# EAGLE schematic Pradeep (EAGLE 7.6.0)
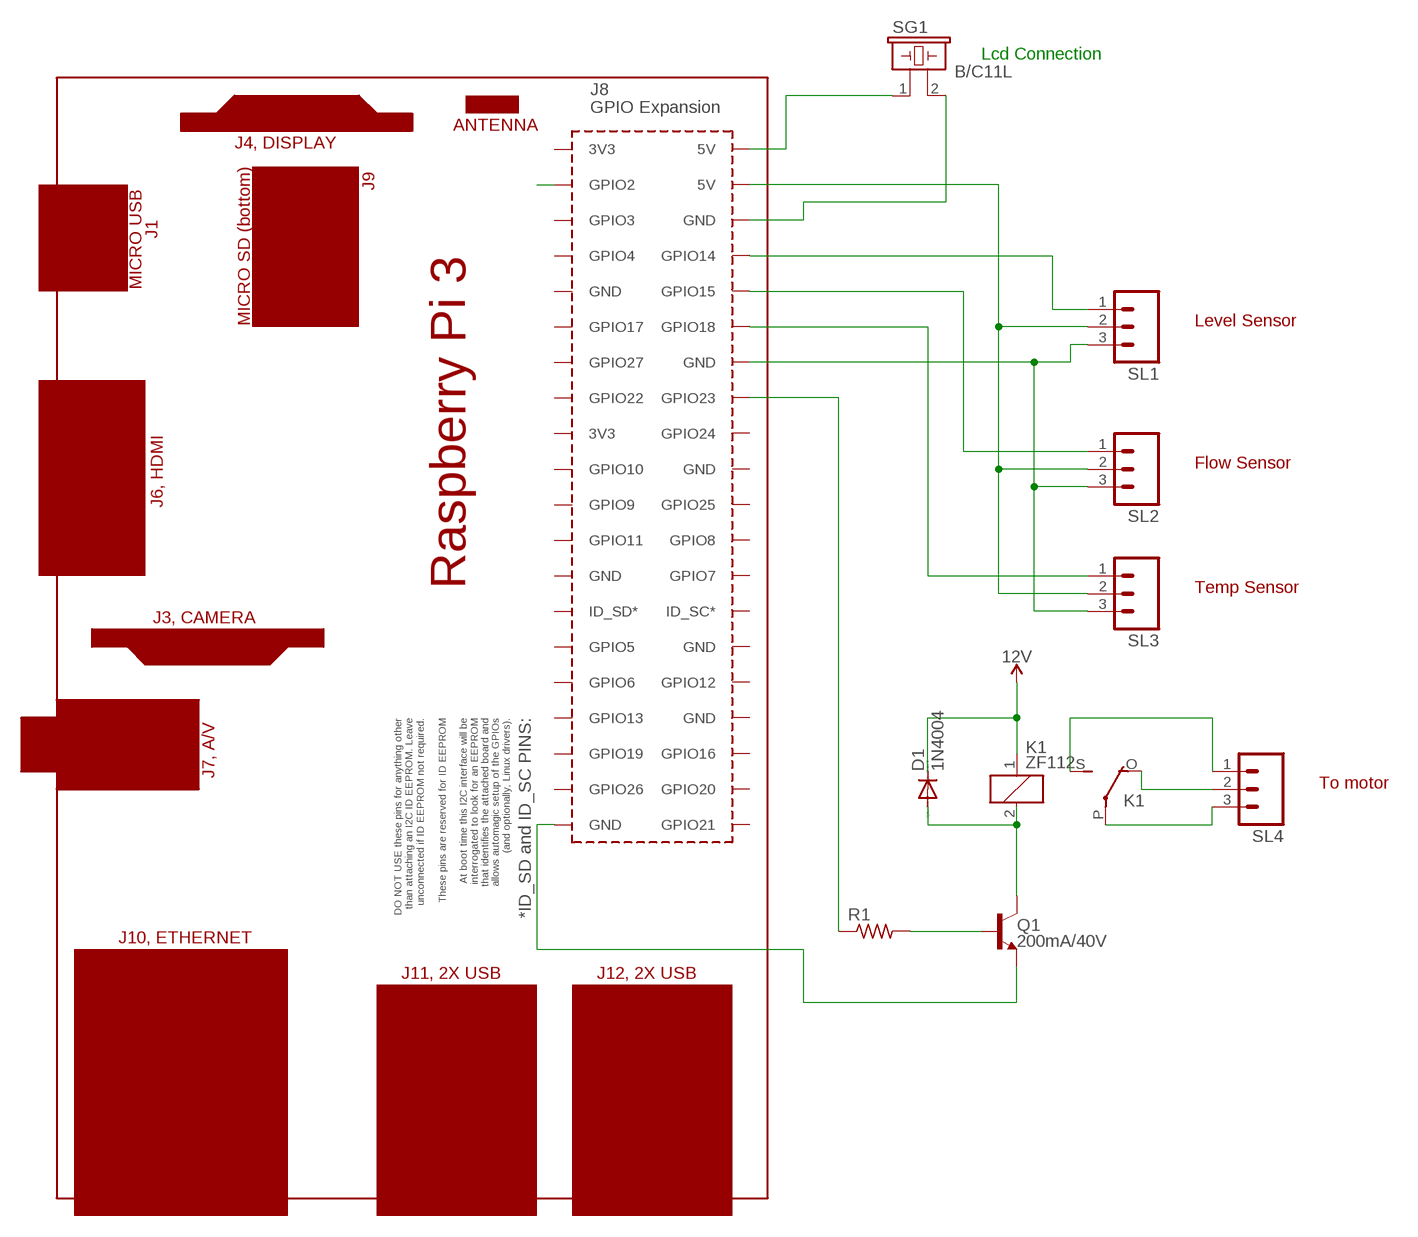
[diagram p0: schematic, sheet 1]

## Parts
D1  1N4004  [DO41-10]
K1  ZF112  [ZF112]
PCB1  RPI3_EXT  (no package)
Q1  200mA/40V  TRANS_NPN-2N3904-EZ  [TO-92-EZ]
R1  R-US_0204/7  [0204/7]
SG1  B/C11L  [B/C11L]
SL1  MA03  [03P]
SL2  MA03  [03P]
SL3  MA03  [03P]
SL4  MA03  [03P]

## Nets
12V: D1.C K1.1
N$1: PCB1.GPIO2
N$2: PCB1.GPIO14 SL1.1
N$3: PCB1.GPIO15 SL2.1
N$4: PCB1.GND SL1.3 SL2.3 SL3.3
N$5: PCB1.5V SL1.2 SL2.2 SL3.2
N$7: PCB1.GPIO18 SL3.1
N$8: D1.A Q1.3(C)
N$10: Q1.2(B) R1.2
N$11: PCB1.GND Q1.1(E)
N$12: PCB1.GPIO23 R1.1
N$13: K1.S(2:S) SL4.1
N$14: K1.O(2:O) SL4.2
N$15: K1.P(2:P) SL4.3
N$24: PCB1.5V SG1.1
N$25: PCB1.GND SG1.2
Unconnected: K1.2 PCB1.3V3 PCB1.GND PCB1.GPIO3 PCB1.GPIO4 PCB1.GPIO5 PCB1.GPIO6 PCB1.GPIO7 PCB1.GPIO8 PCB1.GPIO9 PCB1.GPIO10 PCB1.GPIO11 PCB1.GPIO12 PCB1.GPIO13 PCB1.GPIO16 PCB1.GPIO17 PCB1.GPIO19 PCB1.GPIO20 PCB1.GPIO21 PCB1.GPIO22 PCB1.GPIO24 PCB1.GPIO25 PCB1.GPIO26 PCB1.GPIO27 PCB1.ID_SC* PCB1.ID_SD*

## Notes on the sheet
- Lcd Connection
- Level Sensor
- Flow Sensor
- Temp Sensor
- To motor

## Library data of the parts
D1 = diode:1N4004: DIODE general purpose rectifier, 1 A
K1 = relay:ZF112: RELAY 1 x switch; OC_FARNELL: unknown; OC_NEWARK: unknown
PCB1 = e14_Rpi3_RevA+mirror-pcb:RPI3_EXT: Device for Raspberry Pi 3 without an associated package created by Dave Young for www.element14.com. Intended to allow the addition of a Pi3 in a schematic to show how wired connectins are made to the board without having a footprint on the board. More information available at: https://www.element14.com/community/community/raspberry-pi
Q1 = SparkFun-DiscreteSemi:TRANS_NPN: NPN transistor Current controlled devices typically used to amplify current or used as a switch. BC547 - COM-08928 <http://www.sparkfun.com/products/8928> (TO-92 45V 100mA) (1.Collector 2.Base 3.Emitter) 2N3904 - COM-00521 <http://www.sparkfun.com/products/521> (TO-92 40V 200mA) (1.Emitter 2.Base 3.Collector) P2N2222A - COM-12852 <http://www.sparkfun.com/products/12852> (TO-92 40V 600mA) (1.Collector 2.Base 3.Emitter); PROD_ID: TRANS-08447
R1 = rcl:R-US_: RESISTOR, American symbol
SG1 = buzzer:B/C11L: BUZZER Source: Buerklin; OC_FARNELL: unknown; OC_NEWARK: unknown
SL1-SL4 = con-amp-quick:MA03: AMP QUICK CONNECTOR; OC_FARNELL: unknown; OC_NEWARK: unknown